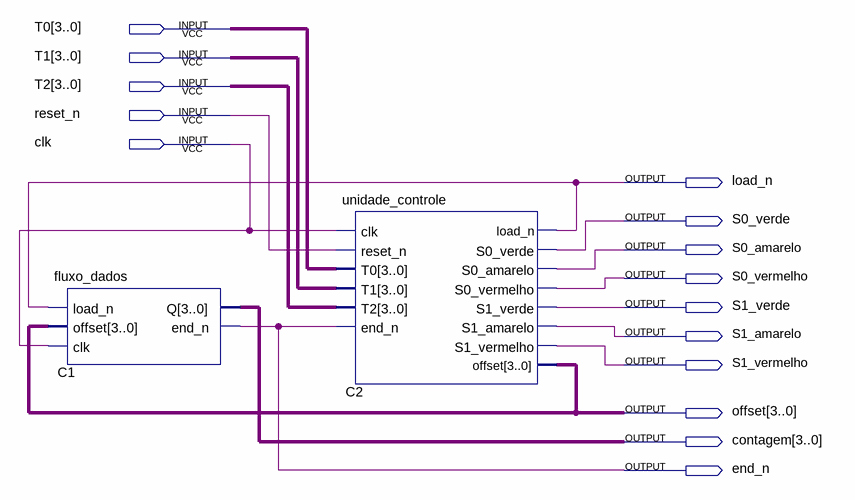
[diagram p0: schematic sheet]
// Quartus schematic semaforo.bdf as structural Verilog: 2 symbols, 15 pins
module semaforo (
  input  [3:0] T0,
  input  [3:0] T1,
  input  [3:0] T2,
  input  reset_n,
  input  clk,
  output load_n,
  output S0_verde,
  output S0_amarelo,
  output S0_vermelho,
  output S1_verde,
  output S1_amarelo,
  output S1_vermelho,
  output [3:0] offset,
  output [3:0] contagem,
  output end_n
);

  fluxo_dados C1 (.load_n(load_n), .offset(offset), .clk(clk), .Q(contagem), .end_n(end_n));
  unidade_controle C2 (
    .clk(clk), .reset_n(reset_n), .T0(T0), .T1(T1), .T2(T2), .end_n(end_n), .load_n(load_n),
    .S0_verde(S0_verde), .S0_amarelo(S0_amarelo), .S0_vermelho(S0_vermelho), .S1_verde(S1_verde),
    .S1_amarelo(S1_amarelo), .S1_vermelho(S1_vermelho), .offset(offset));
endmodule
